# Altium schematic sheet 5V_Efuses.SchDoc
size A4; SheetNumber: 6; SheetTotal: 6
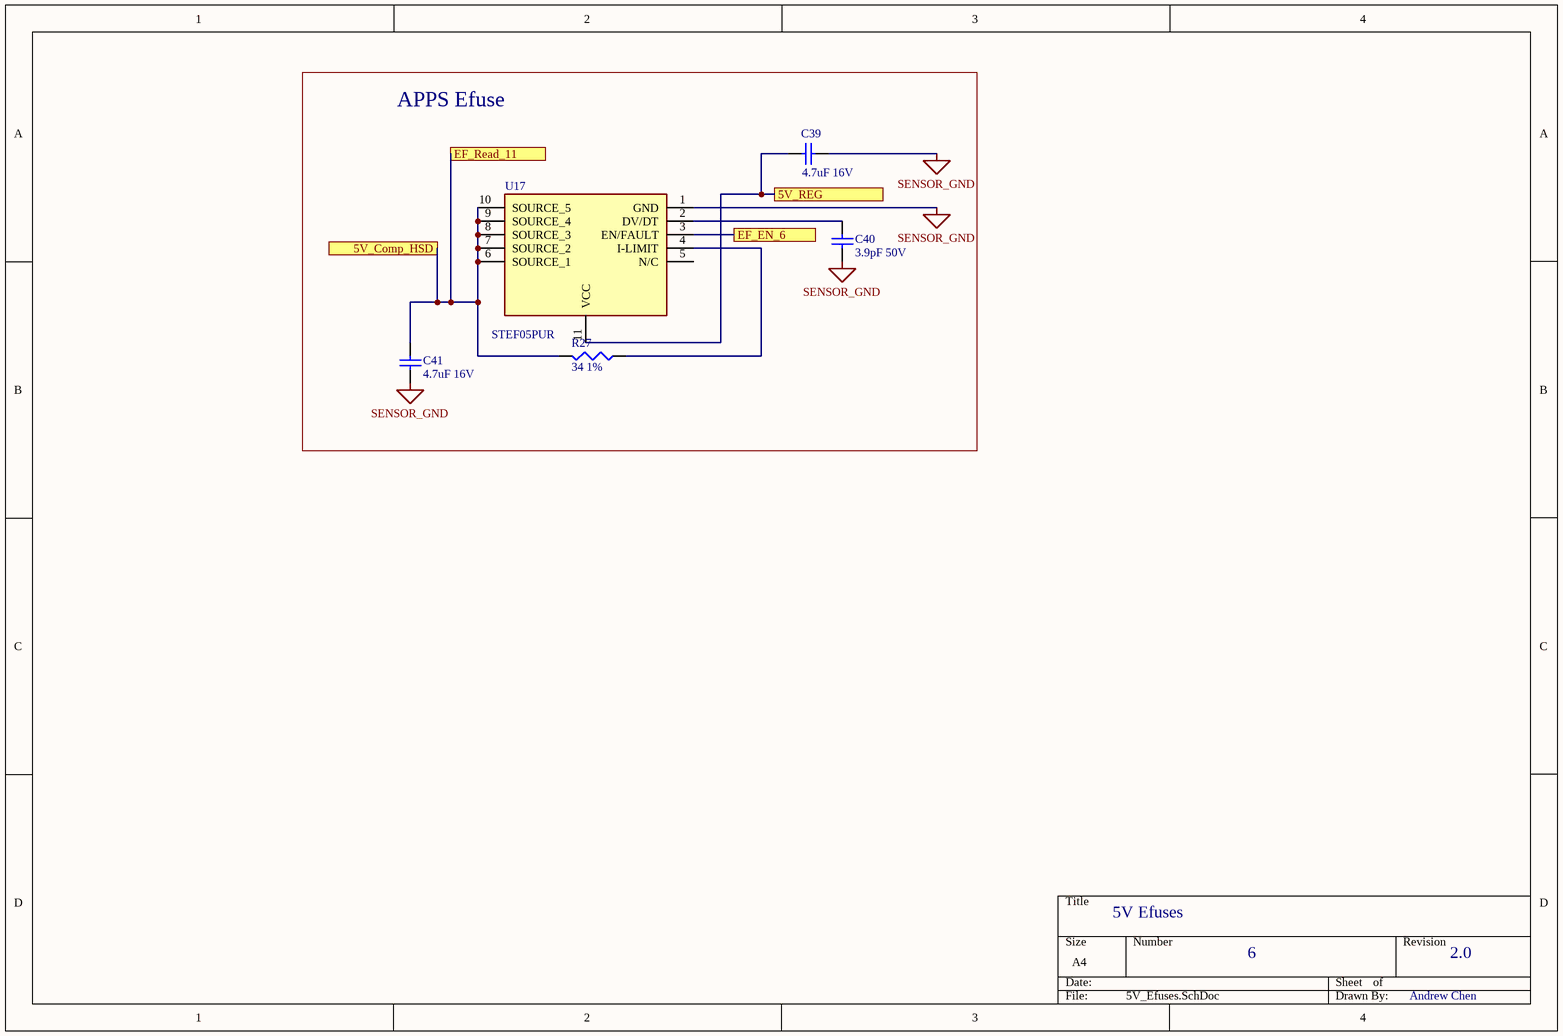
[diagram p0: 5V_Efuses.SchDoc]

## Parts
C39  4.7uF 16V  [C1206]
C40  3.9pF 50V  [C1206]
C41  4.7uF 16V  [C1206]
R27  34 1%  [J1-0603]
U17  STEF05PUR  [SON50P300X300X100-11N-D]

## Blocks framed on the sheet
APPS Efuse: C39-C41 R27 U17

## Ports
5V_Comp_HSD, 5V_REG, EF_EN_6, EF_Read_11

## Nets
SENSOR_GND: C39.2 C40.2 C41.2 U17.1(GND)
5V_Comp_HSD: C41.1 R27.2 U17.6(SOURCE_1) U17.7(SOURCE_2) U17.8(SOURCE_3) U17.9(SOURCE_4) U17.10(SOURCE_5) ; port EF_Read_11, port 5V_Comp_HSD
5V_REG: C39.1 U17.11(VCC) ; port 5V_REG
EF_EN_6: U17.3(EN/FAULT) ; port EF_EN_6
NetC40_1: C40.1 U17.2(DV/DT)
NetR27_1: R27.1 U17.4(I-LIMIT)

Not connected (* = marked no-connect by the designer): U17 5(N/C)

## Notes on the sheet
- 5V Efuses
- 6
- 2.0
- Andrew Chen

## Library data of the parts
C39-C41 = Cap Semi: Capacitor (Semiconductor SIM Model); Value: 22pF; Published: 8-Jun-2000; LatestRevisionDate: 29-May-2009; LatestRevisionNote: IPC-7351 Footprint Added.; PackageReference: C1206; Publisher: Altium Limited; PackageDescription: Chip Capacitor
R27 = Res3: Resistor; Value: 220; Published: 8-Jun-2000; LatestRevisionDate: 29-May-2009; LatestRevisionNote: IPC-7351 Footprint Added.; PackageReference: J1-0603; Publisher: Altium Limited; PackageDescription: Chip Resistor
U17 = STEF12EPUR: Integrated Circuit; Manufacturer_Name: STMicroelectronics; Datasheet Link: https://www.arrow.com/en/products/stef12epur/stmicroelectronics; Height: 1mm; Manufacturer_Part_Number: STEF12EPUR; Mouser Part Number: 511-STEF12EPUR; Mouser Price/Stock: https://www.mouser.co.uk/ProductDetail/STMicroelectronics/STEF12EPUR?qs=mKNKSX85ZJfL9n%252BG1BPmuw%3D%3D; Arrow Part Number: STEF12EPUR; Arrow Price/Stock: https://www.arrow.com/en/products/stef12epur/stmicroelectronics